# Altium project Board_Lora_FullOption.PrjPcb
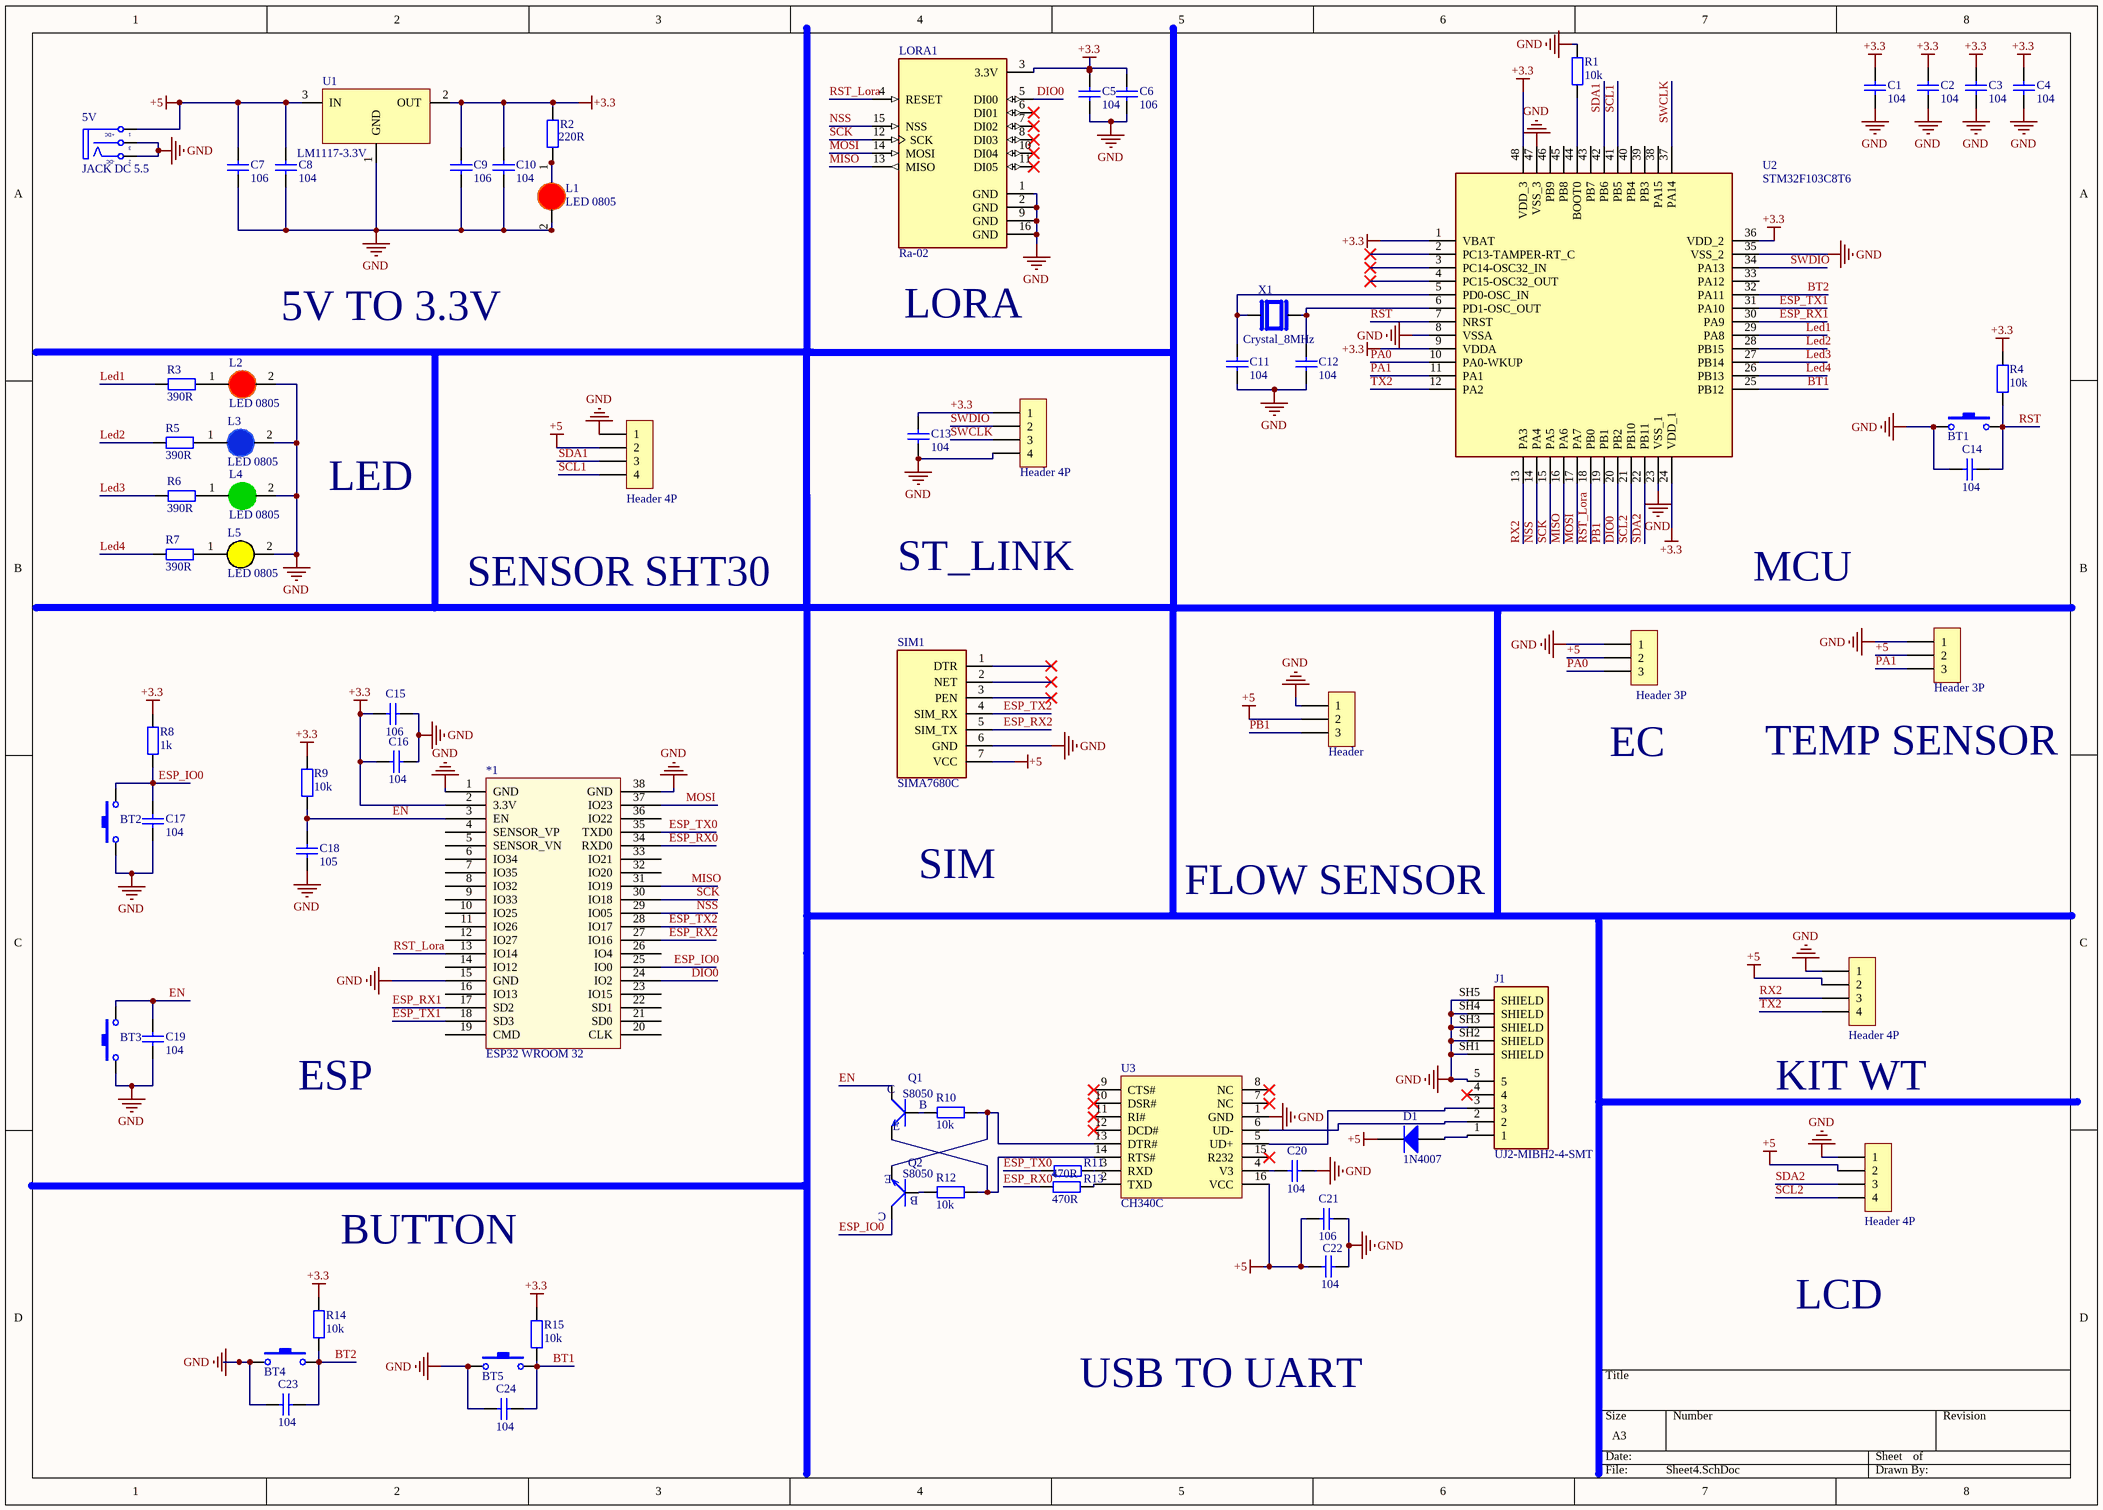
[diagram p0: Sheet4.SchDoc]
1 sheet, 68 parts. Net scope: global (net labels, ports and power ports of the same name join across sheets).
Board file: PCB4.PcbDoc

## Sheet Sheet4.SchDoc
size A3; SheetNumber: 1; SheetTotal: 1

### Parts
5V  JACK DC 5.5  [JACK DC 5.5]
*1  ESP32 WROOM 32  [ESP32-WROOM-32D]
BT1  Nut Nhan 2 Chan SMD 3x6x2.5  [Nut Nhan 2 Chan SMD 3x6x2.5]  (value not drawn)
BT2  Nut Nhan 2 Chan SMD 3x6x2.5  [Nut Nhan 2 Chan SMD 3x6x2.5]  (value not drawn)
BT3  Nut Nhan 2 Chan SMD 3x6x2.5  [Nut Nhan 2 Chan SMD 3x6x2.5]  (value not drawn)
BT4  Nut Nhan 2 Chan SMD 3x6x2.5  [Nut Nhan 2 Chan SMD 3x6x2.5]  (value not drawn)
BT5  Nut Nhan 2 Chan SMD 3x6x2.5  [Nut Nhan 2 Chan SMD 3x6x2.5]  (value not drawn)
C1  104  [tu 1206]
C2  104  [tu 1206]
C3  104  [tu 1206]
C4  104  [tu 1206]
C5  104  [tu 1206]
C6  106  [tu 1206]
C7  106  [tu 1206]
C8  104  [tu 1206]
C9  106  [tu 1206]
C10  104  [tu 1206]
C11  104  [tu 1206]
C12  104  [tu 1206]
C13  104  [tu 1206]
C14  104  [tu 1206]
C15  106  [tu 1206]
C16  104  [tu 1206]
C17  104  [tu 1206]
C18  105  [tu 1206]
C19  104  [tu 1206]
C20  104  [tu 1206]
C21  106  [tu 1206]
C22  104  [tu 1206]
C23  104  [tu 1206]
C24  104  [tu 1206]
D1  1N4007  [DIODE SMA]
EC  Header 3P  [XH2.54M-3]
Flow  Header  [XH2.54M-3]
J1  UJ2-MIBH2-4-SMT  [Micro]
KIT_WT  Header 4P  [XH2.54M-4]
L1  LED 0805  [LED-1206-Red]
L2  LED 0805  [LED-1206-Red]
L3  LED 0805  [LED-1206-Blue]
L4  LED 0805  [LED-1206-Green]
L5  LED 0805  [LED-1206-Yellow]
LCD  Header 4P  [XH2.54M-4]
LORA1  Ra-02  [Sx1278]
Q1  S8050  [S8050]
Q2  S8050  [S8050]
R1  10k  [tro smd 1206]
R2  220R  [tro smd 1206]
R3  390R  [Tro smd 1206]
R4  10k  [tro smd 1206]
R5  390R  [Tro smd 1206]
R6  390R  [Tro smd 1206]
R7  390R  [Tro smd 1206]
R8  1k  [tro smd 1206]
R9  10k  [tro smd 1206]
R10  10k  [tro smd 1206]
R11  470R  [tro smd 1206]
R12  10k  [tro smd 1206]
R13  470R  [tro smd 1206]
R14  10k  [tro smd 1206]
R15  10k  [tro smd 1206]
SHT3x  Header 4P  [XH2.54M-4]
SIM1  SIMA7680C  [SIMA7680C]
ST_Link  Header 4P  [XH2.54M-4]
Temp_w  Header 3P  [XH2.54M-3]
U1  LM1117-3.3V  [SOT223]
U2  STM32F103C8T6  [LQFP-48_19.6_393_58X11_SMD]
U3  CH340C  [SOIC16_50_284_25X90_SMT]
X1  Crystal_8MHz  [XTAL_8MHz]

### Nets
+3.3: *1.2(3.3V) C1.1 C2.1 C3.1 C4.1 C5.1 C6.1 C9.1 C10.1 C13.2 C15.2 C16.2 LORA1.3(3.3V) R2.2 R4.2 R8.2 R9.2 R14.2 R15.2 ST_Link.1 U1.2(OUT) U2.1(VBAT) U2.9(VDDA) U2.24(VDD_1) U2.36(VDD_2) U2.48(VDD_3)
+5: 5V.1(T) C7.1 C8.1 C21.1 C22.1 D1.2(K) EC.2 Flow.2 KIT_WT.2 LCD.2 SHT3x.2 SIM1.7(VCC) Temp_w.2 U1.3(IN) U3.16(VCC)
GND: 5V.2(TN) 5V.3(S) *1.1(GND) *1.15(GND) *1.38(GND) BT1.1 BT2.1 BT3.1 BT4.1 BT5.1 C1.2 C2.2 C3.2 C4.2 C5.2 C6.2 C7.2 C8.2 C9.2 C10.2 C11.2 C12.2 C13.1 C14.1 C15.1 C16.1 C17.2 C18.2 C19.2 C20.2 C21.2 C22.2 C23.1 C24.1 EC.1 Flow.1 J1.5 J1.SH1(SHIELD) J1.SH2(SHIELD) J1.SH3(SHIELD) J1.SH4(SHIELD) J1.SH5(SHIELD) KIT_WT.1 L1.2(K) L2.2(K) L3.2(K) L4.2(K) L5.2(K) LCD.1 LORA1.1(GND) LORA1.2(GND) LORA1.9(GND) LORA1.16(GND) R1.2 SHT3x.1 SIM1.6(GND) ST_Link.4 Temp_w.1 U1.1(GND) U2.8(VSSA) U2.23(VSS_1) U2.35(VSS_2) U2.47(VSS_3) U3.1(GND)
BT1: BT5.2 C24.2 R15.1 U2.25(PB12)
BT2: BT4.2 C23.2 R14.1 U2.32(PA11)
DIO0: *1.24(IO2) LORA1.5(DI00) U2.20(PB2)
EN: *1.3(EN) BT3.2 C18.1 C19.1 Q1.3(C) R9.1
ESP_IO0: *1.25(IO0) BT2.2 C17.1 Q2.3(C) R8.1
ESP_RX0: *1.34(RXD0) R13.1
ESP_RX1: *1.17(SD2) U2.30(PA9)
ESP_RX2: *1.27(IO16) SIM1.5(SIM_TX)
ESP_TX0: *1.35(TXD0) R11.1
ESP_TX1: *1.18(SD3) U2.31(PA10)
ESP_TX2: *1.28(IO17) SIM1.4(SIM_RX)
Led1: R3.1 U2.29(PA8)
Led2: R5.1 U2.28(PB15)
Led3: R6.2 U2.27(PB14)
Led4: R7.1 U2.26(PB13)
MISO: *1.31(IO19) LORA1.13(MISO) U2.16(PA6)
MOSI: *1.37(IO23) LORA1.14(MOSI) U2.17(PA7)
NSS: *1.29(IO05) LORA1.15(NSS) U2.14(PA4)
PA0: EC.3 U2.10(PA0-WKUP)
PA1: Temp_w.3 U2.11(PA1)
PB1: Flow.3 U2.19(PB1)
RST: BT1.2 C14.2 R4.1 U2.7(NRST)
RST_Lora: *1.13(IO14) LORA1.4(RESET) U2.18(PB0)
RX2: KIT_WT.3 U2.13(PA3)
SCK: *1.30(IO18) LORA1.12(SCK) U2.15(PA5)
SCL1: SHT3x.4 U2.41(PB5)
SCL2: LCD.4 U2.21(PB10)
SDA1: SHT3x.3 U2.42(PB6)
SDA2: LCD.3 U2.22(PB11)
SWCLK: ST_Link.3 U2.37(PA14)
SWDIO: ST_Link.2 U2.34(PA13)
TX2: KIT_WT.4 U2.12(PA2)
NetC11_1: C11.1 U2.5(PD0-OSC_IN) X1.1
NetC12_1: C12.1 U2.6(PD1-OSC_OUT) X1.2
NetC20_1: C20.1 U3.4(V3)
NetD1_1: D1.1(A) J1.1
NetJ1_2: J1.2 U3.6(UD-)
NetJ1_3: J1.3 U3.5(UD+)
NetL1_1: L1.1(A) R2.1
NetL2_1: L2.1(A) R3.2
NetL3_1: L3.1(A) R5.2
NetL4_1: L4.1(A) R6.1
NetL5_1: L5.1(A) R7.2
NetQ1_1: Q1.1(B) R10.1
NetQ1_2: Q1.2(E) R12.2 U3.14(RTS#)
NetQ2_1: Q2.1(B) R12.1
NetQ2_2: Q2.2(E) R10.2 U3.13(DTR#)
NetR1_1: R1.1 U2.44(BOOT0)
NetR11_2: R11.2 U3.3(RXD)
NetR13_2: R13.2 U3.2(TXD)

Not connected (* = marked no-connect by the designer): *1 4(SENSOR_VP) 5(SENSOR_VN) 6(IO34) 7(IO35) 8(IO32) 9(IO33) 10(IO25) 11(IO26) 12(IO27) 14(IO12) 16(IO13) 19(CMD) 20(CLK) 21(SD0) 22(SD1) 23(IO15) 26(IO4) 32(IO20) 33(IO21) 36(IO22); J1 4*; LORA1 6(DI01)* 7(DI02)* 8(DI03)* 10(DI04)* 11(DI05)*; SIM1 1(DTR)* 2(NET)* 3(PEN)*; U2 2(PC13-TAMPER-RT_C)* 3(PC14-OSC32_IN)* 4(PC15-OSC32_OUT)* 33(PA12) 38(PA15) 39(PB3) 40(PB4) 43(PB7) 45(PB8) 46(PB9); U3 7(NC)* 8(NC)* 9(CTS#)* 10(DSR#)* 11(RI#)* 12(DCD#)* 15(R232)*

### Notes on the sheet
- 5V TO 3.3V
- (near LORA1) LORA
- LED
- ST_LINK
- MCU
- SENSOR SHT30
- (near EC) EC
- (near Temp_w) TEMP SENSOR
- SIM
- FLOW SENSOR
- ESP
- KIT WT
- BUTTON
- LCD
- USB TO UART
- (in symbol JACK DC 5.5) +DC; -DC

### Library data of the parts
5V = JACK DC 5.5: Value: Jac DC
BT1-BT5 = Nut Nhan 2 Chan SMD 3x6x2.5: Ma_Hang: MH001036; Ten: Nút Nhấn 2 Chân 3x6x2.5MM SMD
C1-C5 C8 C10-C14 C16 C17 C19 C20 C22-C24 = Tu 1206 104 50V 20%: Dán; Don_Vi: Con; So_Chan: 2; Ten_Linh_Kien: Tụ 1206 104-0.1uF 20% 50V; Ma_Hang: MH004544; Chung_Loai: Dán; Kieu_Chan: *
C6 C7 C9 C15 C21 = Tu 1206 106 16V 20%: Dán; Don_Vi: Con; So_Chan: 2; Ten_Linh_Kien: Tụ 1206 106-10uF 20% 16V; Ma_Hang: MH004541; Chung_Loai: Dán; Kieu_Chan: *
C18 = Tu 1206 105 50V 20%: Dán; Don_Vi: Con; So_Chan: 2; Ten_Linh_Kien: Tụ 1206 105-1uF 20% 50V; Ma_Hang: MH004545; Chung_Loai: Dán; Kieu_Chan: *
D1 = Diode M7 ( 4007 ): Dán; Don_Vi: Con; Ten_Linh_Kien: Diode M7 1N4007 SMD 1A 1000V; Ma_Hang: MH000944; Chung_Loai: Dán; Ghi_Chu: *
EC Flow Temp_w = Header 3P 2.54 Duc Thang: Cắm; Ten_Linh_Kien: Header 3P XH2.54-3P Đực Thẳng; Don_Vi: Con; Ma_Hang: MH001292; Chung_Loai: Cắm
J1 = UJ2-MIBH2-4-SMT: Micro B, USB 2.0, 1.8 A, Right Angle, Surface Mount (SMT), USB Receptacle
KIT_WT LCD SHT3x ST_Link = Header 4P 2.54 Duc Thang: Cắm; Ten_Linh_Kien: Header 4P XH2.54-4P Đực Thẳng; Don_Vi: Con; Ma_Hang: MH001285; Chung_Loai: Cắm
L1 L2 = LED 1206 Do: Dán; Don_Vi: Con; Ma_Hang: MH002334; Ten_Linh_Kien: LED1206 Màu Đỏ (Red); Ghi_Chu: *; Kieu_Chan: *; Chung_Loai: Dán
L3 = LED 1206 Xanh Duong: Dán; Don_Vi: Con; Ma_Hang: MH002333; Ten_Linh_Kien: LED1206 Màu Xanh Dương (Blue); Ghi_Chu: *; Kieu_Chan: *; Chung_Loai: Dán
L4 = LED 1206 Xanh La: Dán; Don_Vi: Con; Ma_Hang: MH002947; Ten_Linh_Kien: LED1206 Màu Xanh Lá (Green); Ghi_Chu: *; Kieu_Chan: *; Chung_Loai: Dán
L5 = LED 1206 Vang: Dán; Don_Vi: Con; Ma_Hang: MH002331; Ten_Linh_Kien: LED1206 Màu Vàng (Yellow); Ghi_Chu: *; Kieu_Chan: *; Chung_Loai: Dán
LORA1 = Ra-02: Lora sx1278
Q1 Q2 = S8050: Transistor NPN
R1 R4 R9 R14 R15 = Tro 1206 1% 10k: Dán; Don_Vi: Con; So_Chan: 2; Ten_Linh_Kien: Trở 1206 1% 10k; Ma_Hang: MH005885; Chung_Loai: Dán; Kieu_Chan: *
R2 = Tro 1206 1% 220R: Dán; Ma_Hang: MH005897; Don_Vi: Con; So_Chan: 2; Ten_Linh_Kien: Trở 1206 1% 220R; Chung_Loai: Dán; Kieu_Chan: *
R3 R5-R7 = Tro 1206 5% 390R: Dán; Don_Vi: Con; So_Chan: 2; Ten_Linh_Kien: Trở 1206 5% 390R; Ma_Hang: MH005927; Chung_Loai: Dán; Kieu_Chan: *
R8 = Tro 1206 5% 1k: Dán; Don_Vi: Con; So_Chan: 2; Ten_Linh_Kien: Trở 1206 5% 1k; Ma_Hang: MH005904; Chung_Loai: Dán; Kieu_Chan: *
R10 R12 = Tro 1206 5% 10k: Dán; Don_Vi: Con; So_Chan: 2; Ten_Linh_Kien: Trở 1206 5% 10K; Ma_Hang: MH005909; Chung_Loai: Dán; Kieu_Chan: *
R11 R13 = Tro 1206 1% 680R: Dán; Don_Vi: Con; So_Chan: 2; Ten_Linh_Kien: Trở 1206 5% 680R; Ma_Hang: MH005901; Chung_Loai: Dán; Kieu_Chan: *
U1 = LM1117: 800mA Low-Dropout Linear Regulator; Creator: Nguyen Ba Bien; Website: http://group3i.net
U2 = IC_STM32F103C8T6: ARM® Cortex®-M3 STM32F1 Microcontroller IC 32-Bit 72MHz 64KB (64K x 8) FLASH 48-LQFP (7x7) /; Manufacturer: STMicroelectronics; Alternate Part Number-1: NA; Manufacturer Part Number: STM32F103C8T6; Case/Package: LQFP48; Supplier-1: LCSC; Supplier Part Number-1: STM32F103C8T6
U3 = CH340C: USB Bridge, USB to UART USB 2.0 UART Interface; Manufacturer: Olimex; Alternate Part Number-1: NA; Manufacturer Part Number: CH340C; Case/Package: SOIC16; Supplier-1: LCSC; Supplier Part Number-1: C84681
X1 = Crystal_8MHz: 8MHz